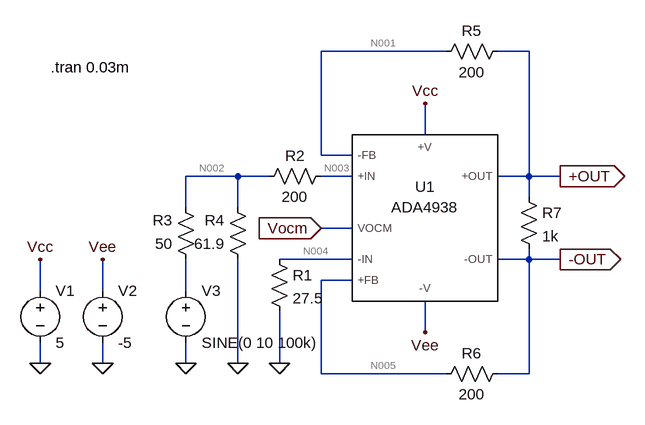
[diagram p0: schematic ADA4938_test.asc]
ADA4938_test.asc, the LTspice schematic file:
Version 4
SHEET 1 880 680
WIRE 256 -96 64 -96
WIRE 384 -96 336 -96
WIRE 224 32 224 -16
WIRE 64 64 64 -96
WIRE 112 64 64 64
WIRE -64 96 -144 96
WIRE -16 96 -64 96
WIRE 112 96 64 96
WIRE 384 96 384 -96
WIRE 384 96 336 96
WIRE 432 96 384 96
WIRE 384 128 384 96
WIRE -144 144 -144 96
WIRE -64 144 -64 96
WIRE 112 176 64 176
WIRE 112 224 0 224
WIRE 384 224 384 208
WIRE 384 224 336 224
WIRE 432 224 384 224
WIRE 112 256 64 256
WIRE -368 272 -368 224
WIRE -272 272 -272 224
WIRE -144 272 -144 224
WIRE 224 336 224 288
WIRE -368 384 -368 352
WIRE -272 384 -272 352
WIRE -144 384 -144 352
WIRE -64 384 -64 224
WIRE 0 384 0 304
WIRE 64 400 64 256
WIRE 256 400 64 400
WIRE 384 400 384 224
WIRE 384 400 336 400
FLAG -272 384 0
FLAG 432 96 +OUT
IOPIN 432 96 Out
FLAG 432 224 -OUT
IOPIN 432 224 Out
FLAG -368 384 0
FLAG -368 224 Vcc
FLAG -272 224 Vee
FLAG 224 -16 Vcc
FLAG 224 336 Vee
FLAG 0 384 0
FLAG -64 384 0
FLAG -144 384 0
FLAG 64 176 Vocm
IOPIN 64 176 In
SYMBOL MyLibrary\\ada4938\\ADA4938-1 224 160 R0
SYMATTR InstName U1
SYMBOL voltage -272 256 R0
SYMATTR InstName V2
SYMATTR Value -5
SYMBOL res -16 208 R0
SYMATTR InstName R1
SYMATTR Value 27.5
SYMBOL res 80 80 R90
WINDOW 0 0 56 VBottom 2
WINDOW 3 32 56 VTop 2
SYMATTR InstName R2
SYMATTR Value 200
SYMBOL voltage -368 256 R0
WINDOW 123 0 0 Left 2
WINDOW 39 0 0 Left 2
SYMATTR InstName V1
SYMATTR Value 5
SYMBOL voltage -144 256 R0
WINDOW 123 0 0 Left 2
WINDOW 39 0 0 Left 2
SYMATTR InstName V3
SYMATTR Value SINE(0 10 100k)
SYMBOL res -128 240 R180
WINDOW 0 36 76 Left 2
WINDOW 3 36 40 Left 2
SYMATTR InstName R3
SYMATTR Value 50
SYMBOL res -48 240 R180
WINDOW 0 36 76 Left 2
WINDOW 3 36 40 Left 2
SYMATTR InstName R4
SYMATTR Value 61.9
SYMBOL res 352 -112 R90
WINDOW 0 0 56 VBottom 2
WINDOW 3 32 56 VTop 2
SYMATTR InstName R5
SYMATTR Value 200
SYMBOL res 352 384 R90
WINDOW 0 0 56 VBottom 2
WINDOW 3 32 56 VTop 2
SYMATTR InstName R6
SYMATTR Value 200
SYMBOL res 368 112 R0
SYMATTR InstName R7
SYMATTR Value 1k
TEXT -352 -72 Left 2 !.tran 0.03m

The netlist it stands for:
* ADA4938_test.asc
XU1 N001 N005 N003 N004 Vcc Vee +OUT -OUT Vocm ADA4938  ; pins -FB +FB +IN -IN +V -V +OUT -OUT VOCM
V2 Vee 0 -5
R1 N004 0 27.5
R2 N003 N002 200
V1 Vcc 0 5
V3 N006 0 SINE(0 10 100k)
R3 N006 N002 50
R4 0 N002 61.9
R5 +OUT N001 200
R6 -OUT N005 200
R7 +OUT -OUT 1k
.tran 0.03m
.lib ADA4938.CIR
.backanno
.end

* Results of the author's LTspice run, read from the files saved beside the schematic
* Operating Point, zero values left out:
*   V(vcc) = 5 V
*   V(vee) = -5 V
*   V(n003) = 397.7 µV
*   V(n004) = 48.03 µV
*   V(-out) = -1.796 V
*   V(+out) = 1.798 V
*   V(vocm) = 1 mV
*   V(n005) = 1.798 V
*   V(n001) = -1.796 V
*   V(n002) = 48.31 µV
*   I(R7) = 3.594 mA
*   I(R6) = -17.97 mA
*   I(R5) = 17.97 mA
*   I(R4) = -780.5 nA
*   I(R3) = -966.2 nA
*   I(R2) = 1.747 µA
*   I(R1) = 1.747 µA
*   I(V3) = 966.2 nA
*   I(V1) = -78.65 mA
*   I(V2) = -41.91 mA
*   Ix(u1:9B) = 17.97 mA
*   Ix(u1:3B) = -17.97 mA
*   Ix(u1:3A) = -1.747 µA
*   Ix(u1:9) = -1.747 µA
*   Ix(u1:99) = 78.65 mA
*   Ix(u1:50) = 41.91 mA
*   Ix(u1:71B) = -21.56 mA
*   Ix(u1:71) = 21.56 mA
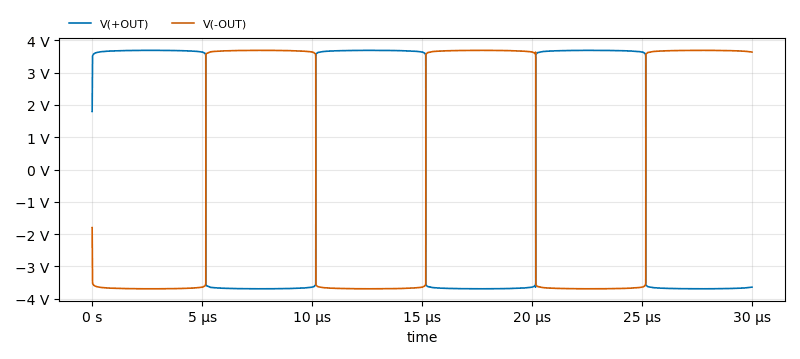
[diagram p1: Transient Analysis of ADA4938_test.asc, plotted from the saved traces]
* Transient Analysis, 1 run:
*   V(+OUT): min -3.691 V, max 3.691 V, average 40.96 mV, rms 3.673 V, last -3.639 V
*   V(-OUT): min -3.691 V, max 3.691 V, average -40.96 mV, rms 3.673 V, last 3.639 V